# EAGLE schematic TiltyDuo (EAGLE 6.5.0)
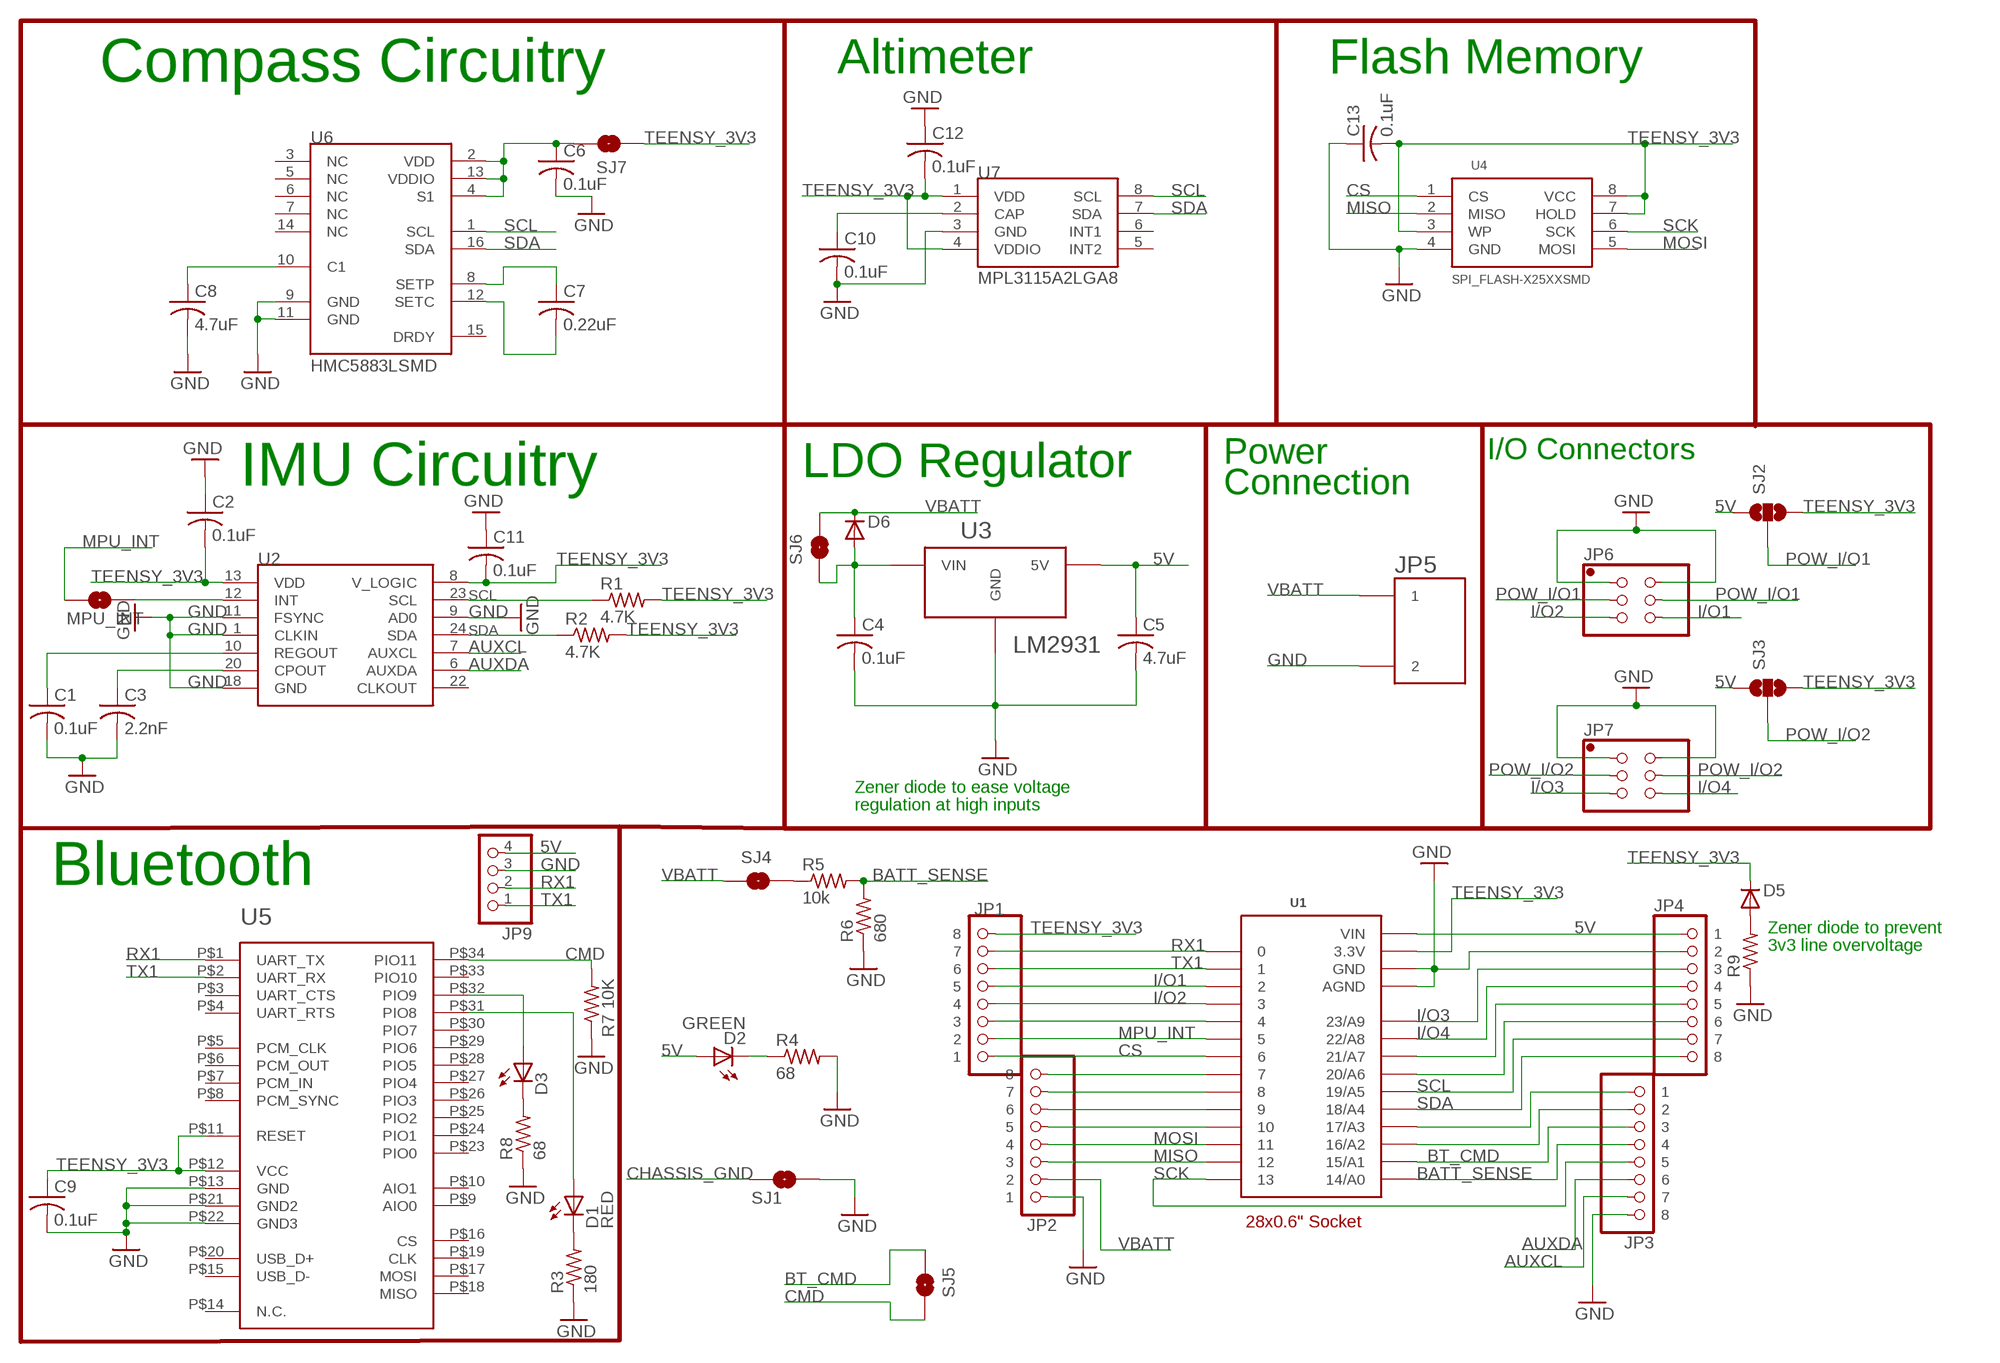
[diagram p0: schematic, sheet 1]

## Parts
C1  0.1uF  C-USC0603  [C0603]
C2  0.1uF  C-USC0603  [C0603]
C3  2.2nF  C-USC0603  [C0603]
C4  0.1uF  C-USC0603  [C0603]
C5  4.7uF  C-USC0603  [C0603]
C6  0.1uF  C-USC0603  [C0603]
C7  0.22uF  C-USC0603  [C0603]
C8  4.7uF  C-USC0603  [C0603]
C9  0.1uF  C-USC0603  [C0603]
C10  0.1uF  C-USC0603  [C0603]
C11  0.1uF  C-USC0603  [C0603]
C12  0.1uF  C-USC0603  [C0603]
C13  0.1uF  C-USC0603  [C0603]
D1  RED  LED-GREENLED-0805_NO_SILK  [LED-0805]
D2  GREEN  LED-GREENLED-0805_NO_SILK  [LED-0805]
D3  YELLOW  LED-GREENLED-0805_NO_SILK  [LED-0805]
D5  DIODESOT23  [SOT23-3]
D6  DIODE-DO214AA  [DO214AA]
JP1  8-PIN_HEADER  [8-PIN_RECEPTACLE_LOCK_NO-SS]
JP2  8-PIN_HEADER  [8-PIN_RECEPTACLE_LOCK_NO-SS]
JP3  8-PIN_HEADER  [8-PIN_RECEPTACLE_LOCK_NO-SS]
JP4  8-PIN_HEADER  [8-PIN_RECEPTACLE_LOCK_NO-SS]
JP5  2-POS_SMD_TERM_BLOCK  [2-POS_SMD_TERMINAL_BLOCK]
JP6  PINHD-2X32X03_NO_SS_LOCK  [2X03_NO_SS_LOCK]
JP7  PINHD-2X32X03_NO_SS_LOCK  [2X03_NO_SS_LOCK]
JP9  PINHD-1X41X04_NO_SS_LOCKING  [1X04_NO_SS_LOCKING]
MPU_INT  SOLDERJUMPERNO  [SJ_2S-NO]
R1  4.7K  R-US_R0603  [R0603]
R2  4.7K  R-US_R0603  [R0603]
R3  180  R-US_R0603  [R0603]
R4  68  R-US_R0603  [R0603]
R5  10k  R-US_R0603  [R0603]
R6  680  R-US_R0603  [R0603]
R7  10K  R-US_R0603  [R0603]
R8  68  R-US_R0603  [R0603]
R9  R-US_R0603  [R0603]
SJ1  SOLDERJUMPERNO  [SJ_2S-NO]
SJ2  SOLDERJUMPER_2WAYPASTE1&2  [SJ_3_PASTE1&2]
SJ3  SOLDERJUMPER_2WAYS  [SJ_3]
SJ4  SOLDERJUMPERTRACE  [SJ_2S-TRACE]
SJ5  SOLDERJUMPERTRACE  [SJ_2S-TRACE]
SJ6  SOLDERJUMPERTRACE  [SJ_2S-TRACE]
SJ7  SOLDERJUMPERTRACE  [SJ_2S-TRACE]
U1  TEENSY_3.0_OUTER-PINS28-DIP_SOCKET  [28-DIP]
U2  MPU-6050  [QFN-24]
U3  LM2931  [TO263]
U4  SPI_FLASH-X25XXSMD  [SO08]
U5  HC-09_BREAKOUT  [HC-09_BREAKOUT]
U6  HMC5883LSMD  [16LPCC]
U7  MPL3115A2LGA8  [LGA8]

## Nets
5V: C5.1 D2.1(A) JP4.P$1 JP9.4 SJ2.1 SJ3.1 U1.P$15(VIN) U3.P$3(5V)
AUXCL [I/O]: JP3.P$7 U2.7(AUXCL)
AUXDA [I/O]: JP3.P$6 U2.6(AUXDA)
BATT_SENSE: JP3.P$4 R5.2 R6.2 U1.P$27(14/A0)
BT_CMD: JP3.P$3 SJ5.1 U1.P$26(15/A1)
CHASSIS_GND: SJ1.1
CMD: R7.2 SJ5.2 U5.P$34(PIO11)
CS: JP1.P$1 U1.P$8 U4.1(CS)
GND: C1.2 C2.1 C3.2 C4.2 C5.2 C6.2 C8.2 C9.2 C10.2 C11.1 C12.1 C13.1 JP2.P$1 JP3.P$8 JP4.P$2 JP5.P$4 JP6.1 JP6.2 JP7.1 JP7.2 JP9.3 R3.1 R4.2 R6.1 R7.1 R8.1 R9.1 SJ1.2 U1.P$1(GND) U1.P$16(AGND) U2.1(CLKIN) U2.9(AD0) U2.11(FSYNC) U2.18(GND) U3.P$1(GND) U4.4(GND) U5.P$13(GND) U5.P$21(GND2) U5.P$22(GND3) U6.9(GND) U6.11(GND) U7.3(GND)
I/O1: JP1.P$5 JP6.6 U1.P$4
I/O2: JP1.P$4 JP6.5 U1.P$5
I/O3: JP4.P$3 JP7.5 U1.P$18(23/A9)
I/O4: JP4.P$4 JP7.6 U1.P$19(22/A8)
MISO: JP2.P$3 U1.P$14 U4.2(MISO)
MOSI: JP2.P$4 U1.P$13 U4.5(MOSI)
MPU_INT: JP1.P$2 MPU_INT.1 U1.P$7
N$1: C1.1 U2.10(REGOUT)
N$2: C3.1 U2.20(CPOUT)
N$3: D1.2(C) R3.2
N$5: C7.1 U6.8(SETP)
N$6: C7.2 U6.12(SETC)
N$7: JP1.P$3 U1.P$6
N$8: JP2.P$5 U1.P$12
N$9: R5.1 SJ4.2
N$10: JP3.P$1 U1.P$24(17/A3)
N$11: C8.1 U6.10(C1)
N$12: JP2.P$6 U1.P$11
N$13: D2.2(C) R4.1
N$14: D1.1(A) U5.P$31(PIO8)
N$16: MPU_INT.2 U2.12(INT)
N$17 [3.3V]: C6.1 SJ7.2 U6.2(VDD) U6.4(S1) U6.13(VDDIO)
N$18: JP4.P$5 U1.P$20(21/A7)
N$19: JP4.P$6 U1.P$21(20/A6)
N$21: C10.1 U7.2(CAP)
N$22: D5.1(A) R9.2
N$23: JP3.P$2 U1.P$25(16/A2)
N$24: D3.2(C) R8.2
POW_I/O1: JP6.3 JP6.4 SJ2.2
POW_I/O2: JP7.3 JP7.4 SJ3.2
RX1: JP1.P$7 JP9.2 U1.P$2 U5.P$1(UART_TX)
RX3: JP2.P$8 U1.P$9
SCK: JP3.P$5 U1.P$28 U4.6(SCK)
SCL [I/O]: JP4.P$7 R1.1 U1.P$22(19/A5) U2.23(SCL) U6.1(SCL) U7.8(SCL)
SDA [I/O]: JP4.P$8 R2.1 U1.P$23(18/A4) U2.24(SDA) U6.16(SDA) U7.7(SDA)
TEENSY_3V3 [3.3V]: C2.2 C9.1 C11.2 C12.2 C13.2 D5.3(C) JP1.P$8 R1.2 R2.2 SJ2.3 SJ3.3 SJ7.1 U1.P$17(3.3V) U2.8(V_LOGIC) U2.13(VDD) U4.3(WP) U4.7(HOLD) U4.8(VCC) U5.P$11(RESET) U5.P$12(VCC) U7.1(VDD) U7.4(VDDIO)
TX1: JP1.P$6 JP9.1 U1.P$3 U5.P$2(UART_RX)
TX3: JP2.P$7 U1.P$10
VBATT: C4.1 D6.A D6.C JP2.P$2 JP5.P$3 SJ4.1 SJ6.1 SJ6.2 U3.P$2(VIN)
YEL_LED: D3.1(A) U5.P$32(PIO9)
Unconnected: U2.22(CLKOUT) U5.P$3(UART_CTS) U5.P$4(UART_RTS) U5.P$5(PCM_CLK) U5.P$6(PCM_OUT) U5.P$7(PCM_IN) U5.P$8(PCM_SYNC) U5.P$9(AIO0) U5.P$10(AIO1) U5.P$14(N.C.) U5.P$15(USB_D-) U5.P$16(CS) U5.P$17(MOSI) U5.P$18(MISO) U5.P$19(CLK) U5.P$20(USB_D+) U5.P$23(PIO0) U5.P$24(PIO1) U5.P$25(PIO2) U5.P$26(PIO3) U5.P$27(PIO4) U5.P$28(PIO5) U5.P$29(PIO6) U5.P$30(PIO7) U5.P$33(PIO10) U6.3(NC) U6.5(NC) U6.6(NC) U6.7(NC) U6.14(NC) U6.15(DRDY) U7.5(INT2) U7.6(INT1)

## Notes on the sheet
- Compass Circuitry | Altimeter | Flash Memory
- Power | I/O Connectors
- IMU Circuitry | LDO Regulator
- Connection
- Zener diode to ease voltage
- regulation at high inputs
- Bluetooth
- Zener diode to prevent
- 3v3 line overvoltage
- 28x0.6" Socket

## Library data of the parts
C1 C6 C9 C10 C13 = resistor:C-US: CAPACITOR, American symbol; RATED_VOLTAGE: 2
C2 C4 C5 C11 C12 = resistor:C-US: CAPACITOR, American symbol
C3 = resistor:C-US: CAPACITOR, American symbol; RATED_VOLTAGE: 50
C7 C8 = resistor:C-US: CAPACITOR, American symbol; ESR: <200mOhms
D1-D3 = SparkFun-LED:LED-GREEN: Various green LEDs 0603- DIO-00821 LARGE- DIO-00862 LILYPAD- DIO-09910
D5 = SparkFun-DiscreteSemi:DIODE: Diode These are standard reverse protection diodes and small signal diodes. SMA package can handle up to about 1A. SOD-323 can handle about 200mA. What the SOD-323 package when ordering, there are some mfgs out there that are 5-pin packages.; PART#: BZX84C3V3LT1GOSCT-ND
D6 = diode:DIODE-: DIODE
JP1-JP4 = My Parts:8-PIN_HEADER
JP5 = My Parts:2-POS_SMD_TERM_BLOCK; PART#: 277-2337-1-ND; POSSIBLE_ALT: 009276002021106
JP6 JP7 = pinhead:PINHD-2X3: PIN HEADER
JP9 = pinhead:PINHD-1X4: PIN HEADER
MPU_INT SJ1 SJ4-SJ7 = SparkFun-Passives:SOLDERJUMPER: Solder Jumper Standard SMD solder jumper. Used to automate production. Two varients : Normally Open and Normally Closed are the same, but have different paste layers. NC will have a large amount of paste and should jumper during reflow.
R1-R9 = resistor:R-US_: RESISTOR, American symbol
SJ2 SJ3 = SparkFun-Passives:SOLDERJUMPER_2WAY: Solder Jumper 2 way solder jumper
U1 = My Parts:TEENSY_3.0_OUTER-PINS; COST: 0.28; PART#: AE10004-ND; PART#2: A28-LC-TR-R; PART#3: ED3052-5-ND
U2 = SparkFun-Sensors:MPU-6050: MPU-6000 - I2C address is 0x68 with AD0 low and 0x69 with AD0 high.
U3 = on-semiconductor:LM2931; COST: 0.53
U4 = SparkFun-DigitalIC:SPI_FLASH-X25XX: 8pin SPI Flash series x25xx. Works with devices like W25X32 and BR25L32; PART#: S25FL204K0TMFI043
U5 = csr:HC-09_BREAKOUT
U6 = SparkFun:HMC5883L: 3 Axis Digital Compass IC
U7 = SparkFun-Sensors:MPL3115A2: Altimeter/Pressure Sensor, I2C, 1.95V-3.6V supply, 50 to 110kPa